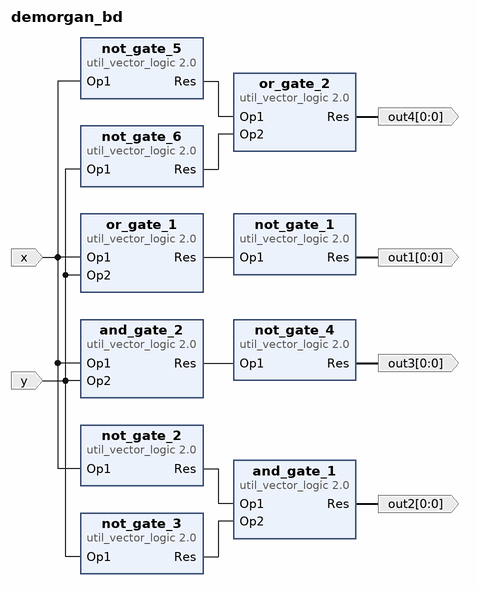
[diagram p0: block diagram of the top level]
# Vivado block design demorgan_bd, xc7a100tfgg484-1, Vivado 2017.4
create_bd_design demorgan_bd

create_bd_port -dir I x
create_bd_port -dir I y
create_bd_port -dir O -from 0 -to 0 out4
create_bd_port -dir O -from 0 -to 0 out3
create_bd_port -dir O -from 0 -to 0 out2
create_bd_port -dir O -from 0 -to 0 out1

create_bd_cell -type ip -vlnv xilinx.com:ip:util_vector_logic:2.0 or_gate_1
set_property -dict {CONFIG.C_SIZE 1 CONFIG.C_OPERATION or} [get_bd_cells or_gate_1]
create_bd_cell -type ip -vlnv xilinx.com:ip:util_vector_logic:2.0 not_gate_1
set_property -dict {CONFIG.C_SIZE 1 CONFIG.C_OPERATION not} [get_bd_cells not_gate_1]
create_bd_cell -type ip -vlnv xilinx.com:ip:util_vector_logic:2.0 not_gate_2
set_property -dict {CONFIG.C_SIZE 1 CONFIG.C_OPERATION not} [get_bd_cells not_gate_2]
create_bd_cell -type ip -vlnv xilinx.com:ip:util_vector_logic:2.0 not_gate_3
set_property -dict {CONFIG.C_SIZE 1 CONFIG.C_OPERATION not} [get_bd_cells not_gate_3]
create_bd_cell -type ip -vlnv xilinx.com:ip:util_vector_logic:2.0 and_gate_1
set_property -dict {CONFIG.C_SIZE 1} [get_bd_cells and_gate_1]
create_bd_cell -type ip -vlnv xilinx.com:ip:util_vector_logic:2.0 and_gate_2
set_property -dict {CONFIG.C_SIZE 1} [get_bd_cells and_gate_2]
create_bd_cell -type ip -vlnv xilinx.com:ip:util_vector_logic:2.0 not_gate_4
set_property -dict {CONFIG.C_SIZE 1 CONFIG.C_OPERATION not} [get_bd_cells not_gate_4]
create_bd_cell -type ip -vlnv xilinx.com:ip:util_vector_logic:2.0 not_gate_5
set_property -dict {CONFIG.C_SIZE 1 CONFIG.C_OPERATION not} [get_bd_cells not_gate_5]
create_bd_cell -type ip -vlnv xilinx.com:ip:util_vector_logic:2.0 not_gate_6
set_property -dict {CONFIG.C_SIZE 1 CONFIG.C_OPERATION not} [get_bd_cells not_gate_6]
create_bd_cell -type ip -vlnv xilinx.com:ip:util_vector_logic:2.0 or_gate_2
set_property -dict {CONFIG.C_SIZE 1 CONFIG.C_OPERATION or} [get_bd_cells or_gate_2]

# ---- connections ----

connect_bd_net [get_bd_ports x] [get_bd_pins or_gate_1/Op1] [get_bd_pins not_gate_2/Op1] [get_bd_pins and_gate_2/Op1] [get_bd_pins not_gate_5/Op1]
connect_bd_net [get_bd_ports y] [get_bd_pins or_gate_1/Op2] [get_bd_pins not_gate_3/Op1] [get_bd_pins and_gate_2/Op2] [get_bd_pins not_gate_6/Op1]
connect_bd_net -net util_vector_logic_0_Res [get_bd_pins or_gate_1/Res] [get_bd_pins not_gate_1/Op1]
connect_bd_net -net util_vector_logic_2_Res [get_bd_pins not_gate_2/Res] [get_bd_pins and_gate_1/Op1]
connect_bd_net -net util_vector_logic_3_Res [get_bd_pins not_gate_3/Res] [get_bd_pins and_gate_1/Op2]
connect_bd_net -net util_vector_logic_5_Res [get_bd_pins and_gate_2/Res] [get_bd_pins not_gate_4/Op1]
connect_bd_net -net util_vector_logic_7_Res [get_bd_pins not_gate_5/Res] [get_bd_pins or_gate_2/Op1]
connect_bd_net -net util_vector_logic_8_Res [get_bd_pins not_gate_6/Res] [get_bd_pins or_gate_2/Op2]
connect_bd_net -net util_vector_logic_9_Res [get_bd_pins or_gate_2/Res] [get_bd_ports out4]
connect_bd_net -net util_vector_logic_6_Res [get_bd_pins not_gate_4/Res] [get_bd_ports out3]
connect_bd_net -net util_vector_logic_4_Res [get_bd_pins and_gate_1/Res] [get_bd_ports out2]
connect_bd_net -net util_vector_logic_1_Res [get_bd_pins not_gate_1/Res] [get_bd_ports out1]

validate_bd_design
save_bd_design
